# EAGLE schematic Relay (EAGLE 8.3.2)
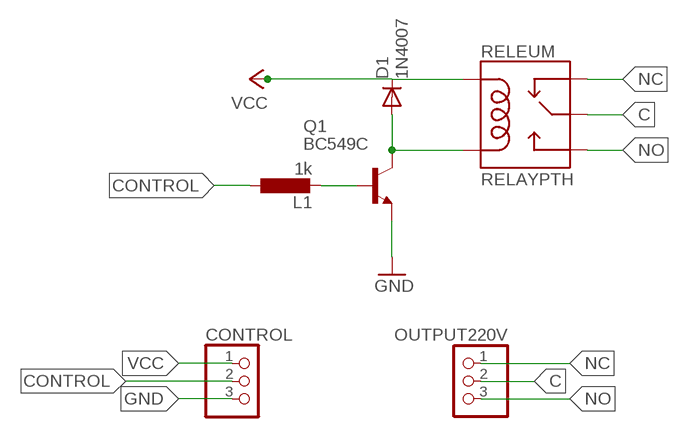
[diagram p0: schematic, sheet 1]

## Parts
CONTROL  PINHD-1X3M  [1X03M]
D1  1N4007  1N4004  [DO41-10]
L1  1k  L-EU0204/7  [0204/7]
OUTPUT220V  PINHD-1X3M  [1X03M]
Q1  BC549C  [TO92-EBC]
RELEUM  RELAYPTH  [SRD-05VDC-SL-C]

## Nets
C: OUTPUT220V.2 RELEUM.SWCOMMON
CONTROL: CONTROL.2 L1.1
GND: CONTROL.3 Q1.E
N$1: L1.2 Q1.B
N$2: D1.A Q1.C RELEUM.COIL0
NC: OUTPUT220V.1 RELEUM.SWCLOSED(SWCLOSE)
NO: OUTPUT220V.3 RELEUM.SWOPEN
VCC: CONTROL.1 D1.C RELEUM.COIL1

## Library data of the parts
CONTROL OUTPUT220V = pinhead:PINHD-1X3: PIN HEADER
D1 = diode:1N4004: DIODE general purpose rectifier, 1 A
L1 = resistor:L-EU: INDUCTOR, European symbol
Q1 = transistor-npn:BC549*: NPN Transistor
RELEUM = SRD-05VDC-SL-C:RELAY: SPDT relay (COM-00101)